# EasyEDA Pro project ProProject_iButton3.1_2024-04-16.epro

# Schematic Schematic1
Create Date: 2024-04-09; Page Name: P1; Project Name: iBtn2; Schematic Name: Schematic1; Update Date: 2024-04-09; Company: 嘉立创EDA; Page Size: A4; Version: V1.0
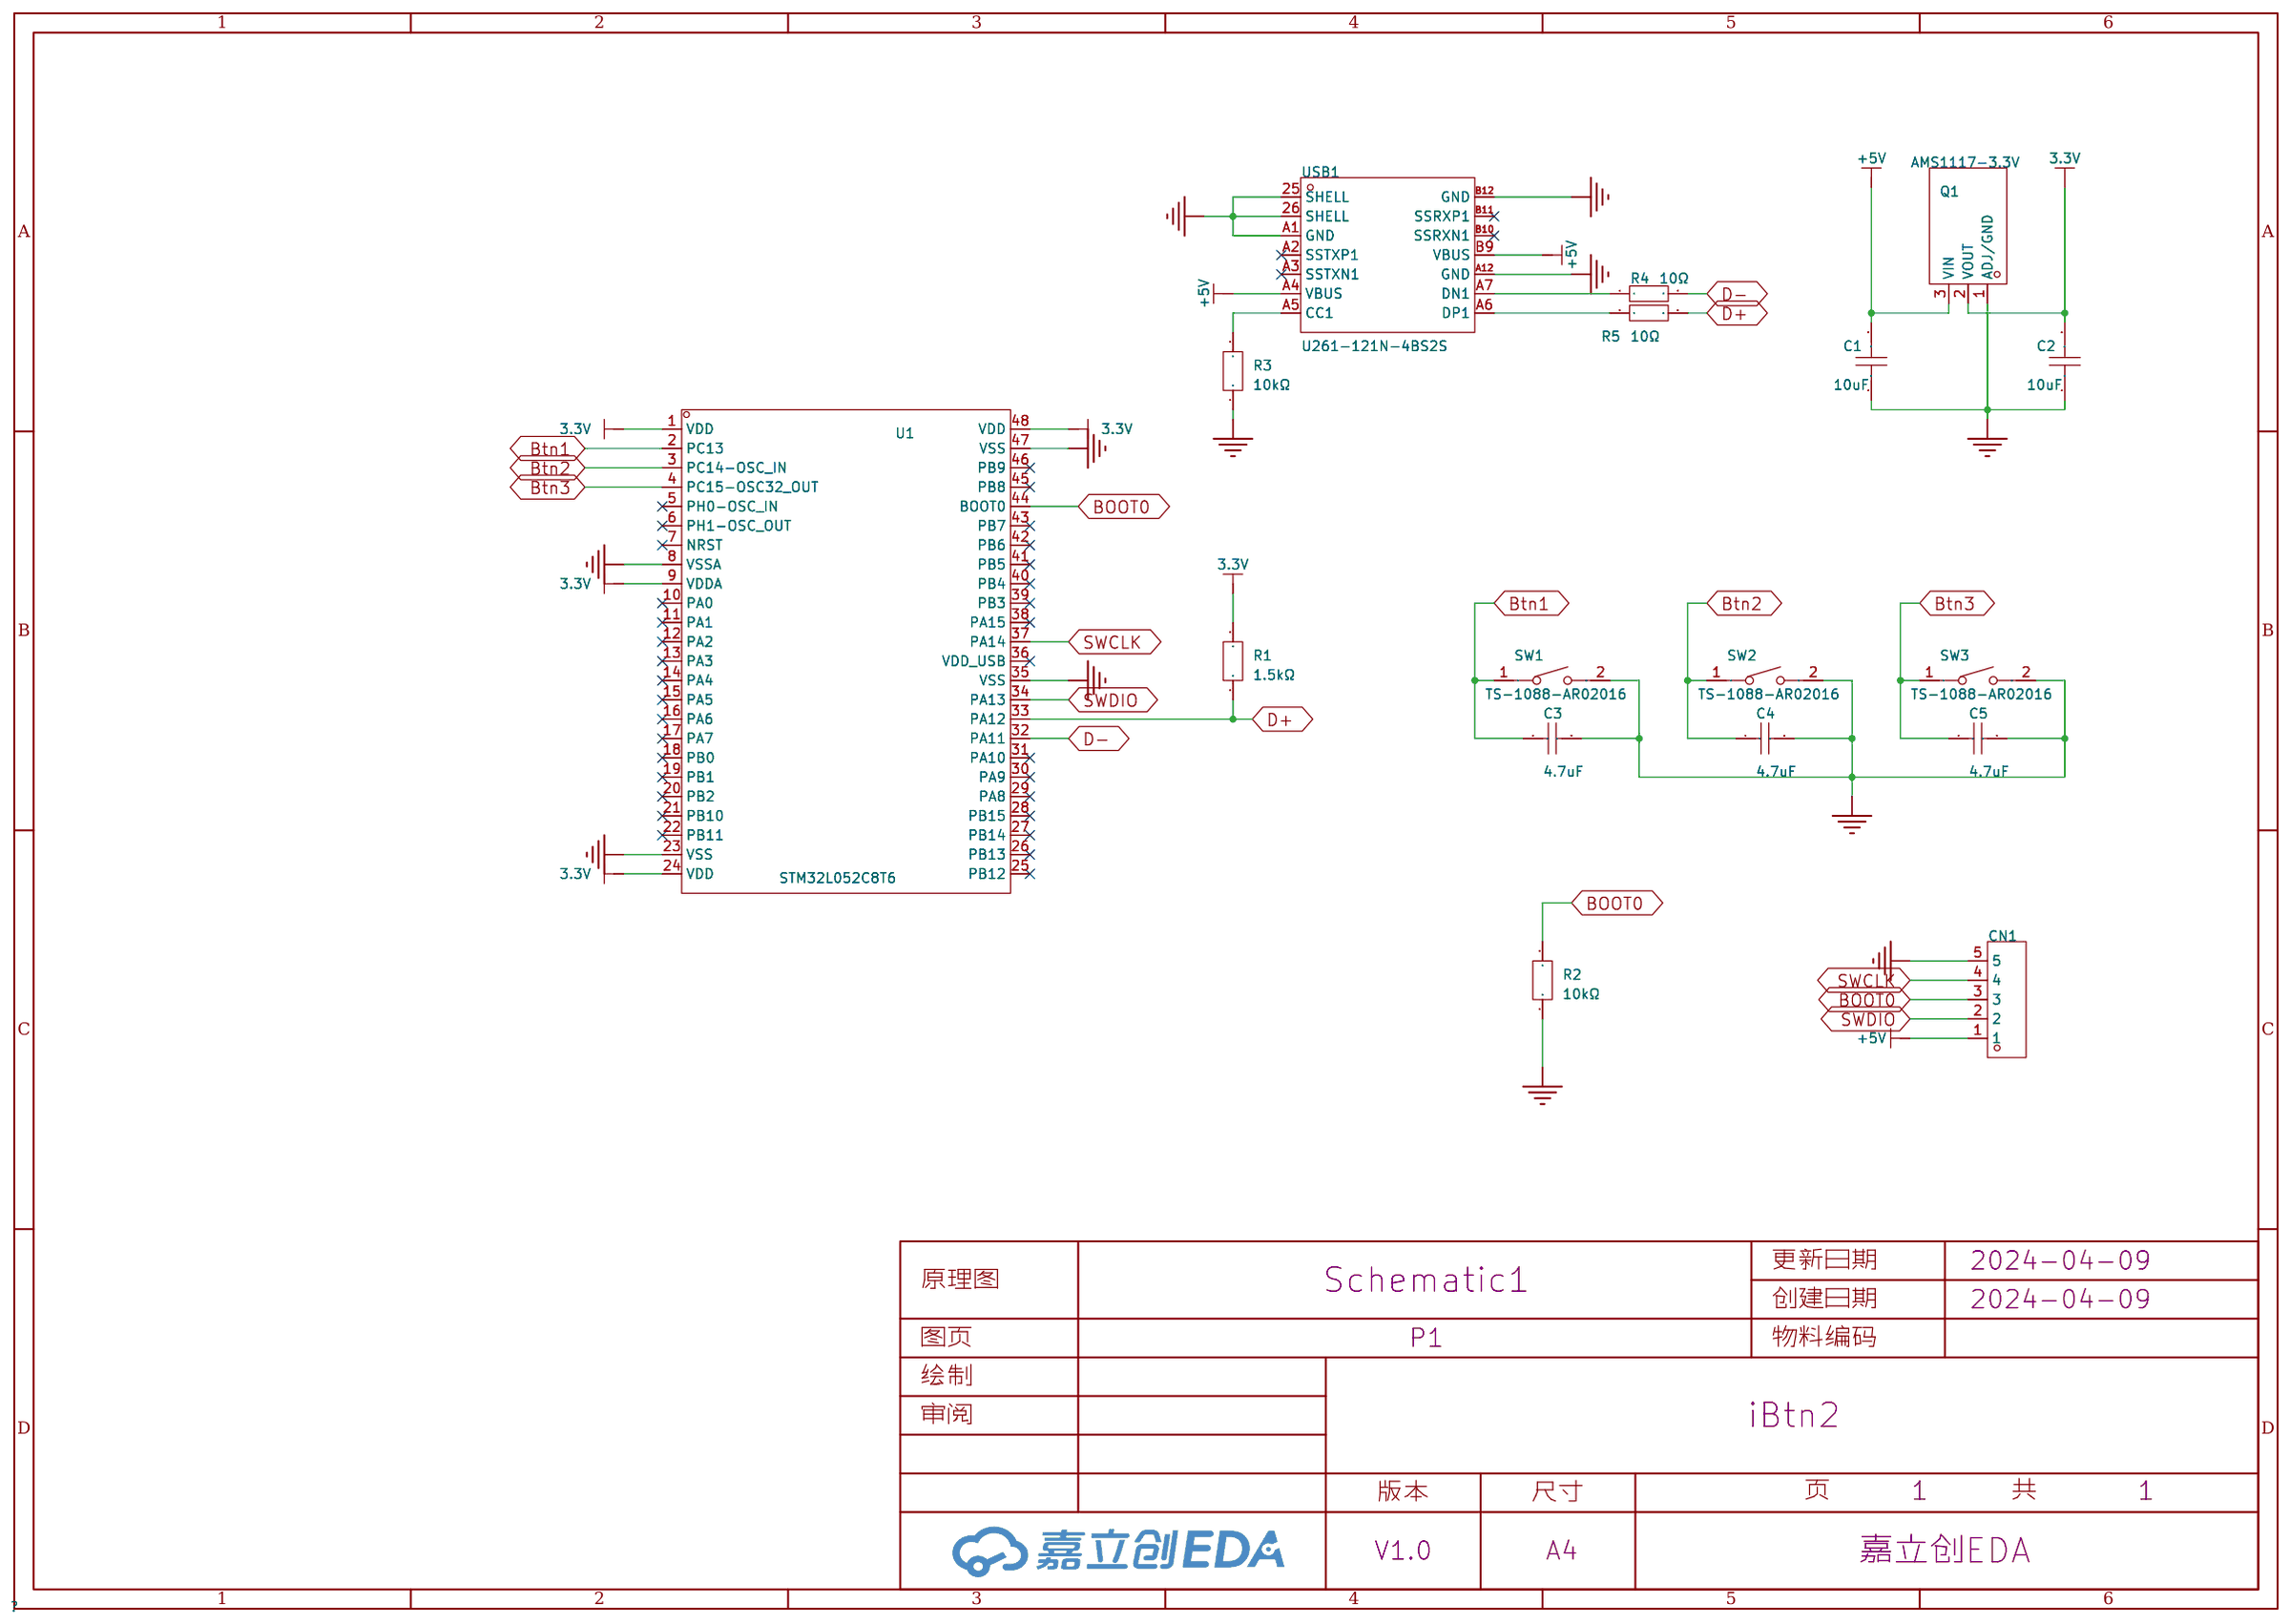
[diagram p0: schematic sheet]

## Parts
C1  10uF  [C0603]
C2  10uF  [C0603]
C3  4.7uF  [C0603]
C4  4.7uF  [C0603]
C5  4.7uF  [C0603]
CN1  MDF7-5S-2.54DSA(55)  [EdgeLink5]
Q1  AMS1117-3.3V  [SOT-89-3_L4.5-W2.5-P1.50-LS4.2-BR]
R1  1.5kΩ  [R0402]
R2  10kΩ  [R0402]
R3  10kΩ  [R0402]
R4  10Ω  [R0402]
R5  10Ω  [R0402]
SW1  TS-1088-AR02016  [SW-SMD_L3.9-W3.0-P4.45]
SW2  TS-1088-AR02016  [SW-SMD_L3.9-W3.0-P4.45]
SW3  TS-1088-AR02016  [SW-SMD_L3.9-W3.0-P4.45]
U1  STM32L052C8T6  [LQFP-48_L7.0-W7.0-P0.50-LS9.0-BL]
USB1  U261-121N-4BS2S  [USB-C-SMD_U261-121N-4BS2S]

## Library data of the parts
C1 C2 = CL10A106KP8NNNC: 容值:10uF;精度:±10%;额定电压:10V;材质(温度系数):X5R;; LCSC Part Name: 10uF ±10% 10V; Supplier Part: C19702; Manufacturer: SAMSUNG(三星); Supplier Footprint: 0603; JLCPCB Part Class: 基础库; Datasheet: https://atta.szlcsc.com/upload/public/pdf/source/20160218/1457707763339.pdf; Supplier: LCSC; Tolerance: ±10%; Voltage Rated: 10V; Temperature Coefficient: X5R
C3-C5 = CL10A475KO8NNNC: 容值:4.7uF;精度:±10%;额定电压:16V;材质(温度系数):X5R;; LCSC Part Name: 4.7uF ±10% 16V; Supplier Part: C19666; Manufacturer: SAMSUNG(三星); Supplier Footprint: 0603; JLCPCB Part Class: 基础库; Datasheet: https://atta.szlcsc.com/upload/public/pdf/source/20160218/1457707763339.pdf; Supplier: LCSC; Tolerance: ±10%; Voltage Rated: 16V; Temperature Coefficient: X5R
CN1 = MDF7-5S-2.54DSA(55): 插孔结构:1x5P;间距:2.54mm;行距:-;圆孔/方孔:方孔;安装类型:直插;排数:单排;总孔位数:5P;额定电流:3A;额定电压:250V;插孔方向:底部;塑高:5mm;触头镀层:锡;工作温度范围:-35℃~+85℃;; LCSC Part Name: 间距:2.54mm 1x5P 直插; Supplier Part: C2692083; Manufacturer: HRS(广濑); Supplier Footprint: 插件,P=2.54mm; JLCPCB Part Class: Extended Part; Datasheet: https://atta.szlcsc.com/upload/public/pdf/source/20211014/DAA5416FDEA50C439628CC91896CF424.pdf; Supplier: LCSC; Holes Structure: 1x5P; Pitch: 2.54mm; Circular Hole / Square Hole: 方孔; Mounting Type: 直插; Number of Rows: 单排; Number of Holes: 5P; Current Rating (Max): 3A; Voltage Rating (Max): 250V; Holes Direction: 底部; Insulation Height: 5mm; Contact Plating: 锡; Operating Temperature Range: -35℃~+85℃
Q1 = AMS1117-3.3V_C5120796: 输出类型:固定;最大输入电压:18V;输出电压:3.3V;最大输出电流:1A;输出极性:正极;; LCSC Part Name: 输入18V 输出3.3V 1A; Supplier Part: C5120796; Manufacturer: MSKSEMI(美森科); Supplier Footprint: SOT-89; JLCPCB Part Class: 扩展库; Datasheet: https://atta.szlcsc.com/upload/public/pdf/source/20231123/6117526697EB8BF6175FDEEBA0877266.pdf; Supplier: LCSC; Output Type: 固定; Maximum Input Voltage: 18V; Output Voltage: 3.3V; MAX Output Current: 1A; Dropout Voltage: 1.4V@(1A); standby current: 12mA; Operating Temperature: 0℃~+125℃; Output Polarity: 正极; Number of Outputs: 1
R1 = 0402WGF1501TCE: 电阻类型:厚膜电阻;阻值:1.5kΩ;精度:±1%;功率:62.5mW;最大工作电压:50V;温度系数:±100ppm/℃;; LCSC Part Name: 1.5kΩ ±1% 62.5mW 厚膜电阻; Supplier Part: C25867; Manufacturer: UNI-ROYAL(厚声); Supplier Footprint: 0402; JLCPCB Part Class: Basic Part; Datasheet: https://atta.szlcsc.com/upload/public/pdf/source/20200306/C422600_1E6D84923E4A46A82E41ADD87F860B5C.pdf; Supplier: LCSC; Type: 厚膜电阻; Tolerance: ±1%; Power(Watts): 62.5mW; Overload Voltage (Max): 50V; Temperature Coefficient: ±100ppm/℃; Operating Temperature Range: -55℃~+155℃
R2 R3 = RC0402FR-0710KL: 电阻类型:厚膜电阻;阻值:10kΩ;精度:±1%;功率:62.5mW;最大工作电压:50V;温度系数:±100ppm/℃;; LCSC Part Name: 厚膜电阻 10kΩ ±1% 62.5mW; Supplier Part: C60490; Manufacturer: YAGEO(国巨); Supplier Footprint: 0402; JLCPCB Part Class: Extended Part; Datasheet: https://atta.szlcsc.com/upload/public/pdf/source/20170925/C131467_1506321478108990263.pdf; Supplier: LCSC; Type: 厚膜电阻; Tolerance: ±1%; Power(Watts): 62.5mW; Overload Voltage (Max): 50V; Temperature Coefficient: ±100ppm/℃; Operating Temperature Range: -55℃~+155℃
R4 R5 = 0402WGF100JTCE: 电阻类型:厚膜电阻;阻值:10Ω;精度:±1%;功率:62.5mW;最大工作电压:50V;温度系数:±200ppm/℃;; LCSC Part Name: 10Ω ±1% 62.5mW 厚膜电阻; Supplier Part: C25077; Manufacturer: UNI-ROYAL(厚声); Supplier Footprint: 0402; JLCPCB Part Class: 基础库; Datasheet: https://atta.szlcsc.com/upload/public/pdf/source/20200306/C422600_1E6D84923E4A46A82E41ADD87F860B5C.pdf; Supplier: LCSC; Type: 厚膜电阻; Tolerance: ±1%; Power(Watts): 62.5mW; Overload Voltage (Max): 50V; Temperature Coefficient: ±200ppm/℃; Operating Temperature Range: -55℃~+155℃
SW1-SW3 = TS-1088-AR02016: 电路结构:单刀单掷;按钮形状:圆形按钮;作用力:160gf;安装方式:立贴;开关长度:4mm;开关宽度:3mm;开关高度:2mm;带支架:不带;触点电流:50mA;额定电压(DC):12V;绝缘电阻:100MΩ;机械寿命:10万次;; LCSC Part Name: 4*3*2mm 立贴 轻触开关; Supplier Part: C720477; Manufacturer: XUNPU(讯普); Supplier Footprint: SMD; JLCPCB Part Class: 扩展库; Datasheet: https://atta.szlcsc.com/upload/public/pdf/source/20200810/C720475_60D09DD6C54279ADDB2DC25100F1CC11.pdf; Supplier: LCSC; Circuit: 单刀单掷; Actuator Style: 圆形按钮; Operating Force: 160gf; Mounting Style: 立贴; Switch Length: 4mm; Switch Width: 3mm; Switch Height: 2mm; Strike Gundam: 不带; Contact Current: 50mA; Voltage Rating (DC): 12V; Insulation Resistance: 100MΩ; Actuator/Cap Color: 黑色; Pin Style: SMD接片; Mechanical Life: 10万次; Operating Temperature: -30℃~+80℃
U1 = STM32L052C8T6: CPU内核:ARM-M系列;程序存储容量:64KB;RAM总容量:8KB;GPIO端口数量:37;工作电压范围:1.65V~3.6V;CPU最大主频:32MHz;程序存储器类型:FLASH;; Supplier Part: C111213; Manufacturer: ST(意法半导体); Supplier Footprint: LQFP-48(7x7); JLCPCB Part Class: 扩展库; Datasheet: https://atta.szlcsc.com/upload/public/pdf/source/20180517/C222404_2834E00F4926DF798538AC243DB2EE37.pdf; Supplier: LCSC; CPU Core: ARM-M系列; Program Storage Size: 64KB; RAM Size: 8KB; GPIO Ports Number: 37; Operating Voltage Range: 1.65V~3.6V; CPU Maximum Speed: 32MHz; Program Memory Type: FLASH; Operating Temperature Range: -40℃~+85℃; ADC (Bit): 12bit; DAC (Bit): 12bit; Universal Serial Bus: 有; Peripheral/Function: PWM；PWM; Watchdog: 有; Infrared Data Association: 有; Low-Voltage Detect: 有; Direct Memory Access: 有; Internal Oscillator: 有
USB1 = U261-121N-4BS2S: 连接器类型:Type-C;标准:USB 2.0;公母:公;端口数量:1;触点数量:12P;安装方式:卧贴;额定电流 - 电源:5A;触头材质:铜合金;触头镀层:金;工作温度范围:-55℃~+85℃;焊接温度(最大值):260℃;; LCSC Part Name: Type-C 公 卧贴; Supplier Part: C2879827; Manufacturer: XKB Connectivity(中国星坤); Supplier Footprint: SMD; JLCPCB Part Class: 扩展库; Datasheet: https://atta.szlcsc.com/upload/public/pdf/source/20230717/E21107E9DFF35184454CF0943FCE0581.pdf; Supplier: LCSC; Connector Type: Type-C; Standard: USB 2.0; Gender: 公; Number of Ports: 1; Number of Contacts: 12P; Mounting Style: 卧贴; Current Rating - Power (Max): 5A; Contact Material: 铜合金; Contact Plating: 金; Operating Temperature Range: -55℃~+85℃; Soldering Temperature(Max): 260℃

## Nets
3.3V: C2.2 Q1.2(VOUT) R1.2 U1.1(VDD) U1.9(VDDA) U1.24(VDD) U1.48(VDD)
+5V: C1.2 CN1.1 Q1.3(VIN) USB1.A4(VBUS) USB1.B9(VBUS)
GND: C1.1 C2.1 C3.2 C4.2 C5.2 CN1.5 Q1.1(ADJ/GND) R2.1 R3.1 SW1.2 SW2.2 SW3.2 U1.8(VSSA) U1.23(VSS) U1.35(VSS) U1.47(VSS) USB1.25(SHELL) USB1.26(SHELL) USB1.A1(GND) USB1.A12(GND) USB1.B12(GND)
BOOT0: CN1.3 R2.2 U1.44(BOOT0)
Btn1: C3.1 SW1.1 U1.2(PC13)
Btn2: C4.1 SW2.1 U1.3(PC14-OSC_IN)
Btn3: C5.1 SW3.1 U1.4(PC15-OSC32_OUT)
D+: R1.1 R5.2 U1.33(PA12)
D-: R4.2 U1.32(PA11)
SWCLK: CN1.4 U1.37(PA14)
SWDIO: CN1.2 U1.34(PA13)
$1N3077: R3.2 USB1.A5(CC1)
$1N3302: R4.1 USB1.A7(DN1)
$1N3305: R5.1 USB1.A6(DP1)

Not connected (* = marked no-connect by the designer): U1 5(PH0-OSC_IN)* 6(PH1-OSC_OUT)* 7(NRST)* 10(PA0)* 11(PA1)* 12(PA2)* 13(PA3)* 14(PA4)* 15(PA5)* 16(PA6)* 17(PA7)* 18(PB0)* 19(PB1)* 20(PB2)* 21(PB10)* 22(PB11)* 25(PB12)* 26(PB13)* 27(PB14)* 28(PB15)* 29(PA8)* 30(PA9)* 31(PA10)* 36(VDD_USB)* 38(PA15)* 39(PB3)* 40(PB4)* 41(PB5)* 42(PB6)* 43(PB7)* 45(PB8)* 46(PB9)*; USB1 A2(SSTXP1)* A3(SSTXN1)* B10(SSRXN1)* B11(SSRXP1)*

# Board PCB1
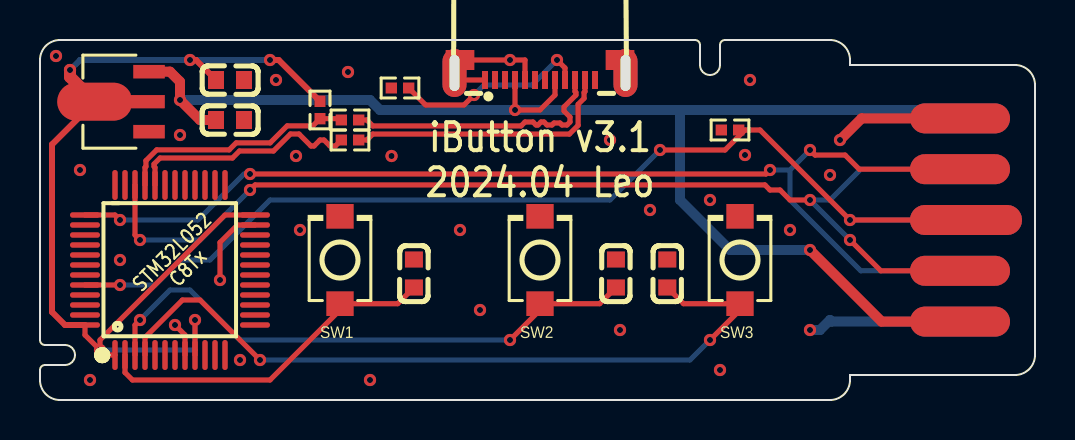
[diagram p1: board, top side]
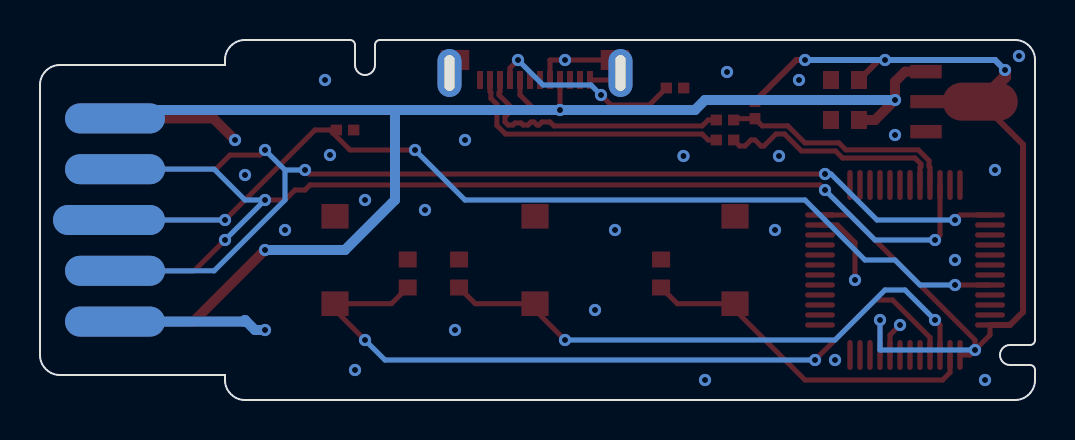
[diagram p2: board, bottom side, seen from below]

Outline 49.75 x 18 mm; copper layers: Top Layer, Bottom Layer. Coordinates in mm from the lower left corner of the outline.
Outline path: 0,17 arc(0.29,17.71) 1,18 32.75,18 arc(32.93,17.93) 33,17.75 33,16.75 arc(33.5,16.25) 34,16.75 34,17.75 arc(34.07,17.93) 34.25,18 39.5,18 arc(40.21,17.71) 40.5,17 40.5,16.75 48.75,16.75 arc(49.46,16.46) 49.75,15.75 49.75,2.25 arc(49.46,1.54) 48.75,1.25 40.5,1.25 40.5,1 arc(40.21,0.29) 39.5,0 1,0 arc(0.29,0.29) 0,1 0,1.5 arc(0.07,1.68) 0.25,1.75 1.25,1.75 arc(1.75,2.25) 1.25,2.75 0.25,2.75 arc(0.07,2.82) 0,3 0,17
Stack: Top Layer 0.035mm / Dielectric1 1.51mm FR4 er 4.5 / Bottom Layer 0.035mm

## Design rules (mm)
net D+: DP1
net D-: DP1
net $1N3305: DP2
net $1N3302: DP2
template: JLCPCB Capability(Two Layers Board)
spacing copperThickness1oz (default): track to track 0.102, other pairs 0.152 to 0.3
spacing copperThickness2oz: track to track 0.203, other pairs 0.152 to 0.3
track width copperThickness1oz (default): min 0.127, default 0.254, max 2.54
track width copperThickness2oz: min 0.203, default 0.254, max 2.54
differential pair differentialPair (default): width min 0.127, default 0.254, max 2.54; gap min 0.152, default 0.152
via viaSize (default): diameter min 0.5, default 0.61, max 10; hole min 0.3, default 0.305, max 6.3

## Placement (name value [footprint] x y rotation side)
C1  10uF  [C0603]  9.5 14 180 top
C2  10uF  [C0603]  9.5 16 180 top
C3  4.7uF  [C0603]  18.7 6.33 90 top
C4  4.7uF  [C0603]  28.8 6.33 90 top
C5  4.7uF  [C0603]  31.37 6.33 90 top
CN1  MDF7-5S-2.54DSA(55)  [EdgeLink5]  46 9 0 top
Q1  AMS1117-3.3V  [SOT-89-3_L4.5-W2.5-P1.50-LS4.2-BR]  4.1 14.92 0 top
R1  1.5kΩ  [R0402]  14 14.5 90 top
R2  10kΩ  [R0402]  34.5 13.5 0 top
R3  10kΩ  [R0402]  18 15.6 0 top
R4  10Ω  [R0402]  15.5 13 180 top
R5  10Ω  [R0402]  15.5 14 180 top
SW1  TS-1088-AR02016  [SW-SMD_L3.9-W3.0-P4.45]  15 7 90 top
SW2  TS-1088-AR02016  [SW-SMD_L3.9-W3.0-P4.45]  25 7 90 top
SW3  TS-1088-AR02016  [SW-SMD_L3.9-W3.0-P4.45]  35 7 90 top
U1  STM32L052C8T6  [LQFP-48_L7.0-W7.0-P0.50-LS9.0-BL]  6.5 6.5 0 top
USB1  U261-121N-4BS2S  [usb-c-smd_u261-121n-4bs2s]  25 16.5 180 top

## Footprints (pads in the part's own frame, mm; a bottom-side part is the same pattern mirrored in y, then rotated)
C0603
  rect 0.8x0.9 smd: 1(-0.7,0) 2(0.7,0)
EdgeLink5
  oval 5x1.5 smd far side: 1(0,5.08) 2(0,2.54) 4(0,-2.54) 5(0,-5.08)
  oval 5x1.5 smd: 1(0,-5.08) 2(0,-2.54) 4(0,2.54) 5(0,5.08)
  oval 5.6x1.5 smd: 3(0.3,0)
  oval 5.6x1.5 smd far side: 3(0.3,0)
LQFP-48_L7.0-W7.0-P0.50-LS9.0-BL
  oval 0.27x1.5 smd: 1(-2.75,-4.25) 2(-2.25,-4.25) 3(-1.75,-4.25) 4(-1.25,-4.25) 5(-0.75,-4.25) 6(-0.25,-4.25) 7(0.25,-4.25) 8(0.75,-4.25) 9(1.25,-4.25) 10(1.75,-4.25) 11(2.25,-4.25) 12(2.75,-4.25) 25(2.75,4.25) 26(2.25,4.25) 27(1.75,4.25) 28(1.25,4.25) 29(0.75,4.25) 30(0.25,4.25) 31(-0.25,4.25) 32(-0.75,4.25) 33(-1.25,4.25) 34(-1.75,4.25) 35(-2.25,4.25) 36(-2.75,4.25)
  oval 1.5x0.27 smd: 13(4.25,-2.75) 14(4.25,-2.25) 15(4.25,-1.75) 16(4.25,-1.25) 17(4.25,-0.75) 18(4.25,-0.25) 19(4.25,0.25) 20(4.25,0.75) 21(4.25,1.25) 22(4.25,1.75) 23(4.25,2.25) 24(4.25,2.75) 37(-4.25,2.75) 38(-4.25,2.25) 39(-4.25,1.75) 40(-4.25,1.25) 41(-4.25,0.75) 42(-4.25,0.25) 43(-4.25,-0.25) 44(-4.25,-0.75) 45(-4.25,-1.25) 46(-4.25,-1.75) 47(-4.25,-2.25) 48(-4.25,-2.75)
R0402
  rect 0.566x0.54 smd: 1(-0.433,0) 2(0.433,0)
SOT-89-3_L4.5-W2.5-P1.50-LS4.2-BR
  rect 1.575x0.672 smd: 1(1.356,-1.5) 3(1.356,1.5)
  custom 5.377x1.9 smd: 2(-1.356,0)
SW-SMD_L3.9-W3.0-P4.45
  rect 1.23x1.36 smd: 1(-2.185,0) 2(2.185,0)
usb-c-smd_u261-121n-4bs2s
  oval 1.2x2.4 hole 0.5x1.8: 25(-4.275,0.15) 26(4.275,0.15)
  rect 1.43x1 smd: 25(-4,-0.5) 26(4,-0.5)
  rect 0.3x0.9 smd: A1(2.75,0.5) A2(2.25,0.5) A3(1.75,0.5) A4(1.25,0.5) A5(-1.25,0.5) A6(-1.75,0.5) A7(-2.25,0.5) A12(-2.75,0.5) B9(-0.75,0.5) B10(-0.25,0.5) B11(0.25,0.5) B12(0.75,0.5)

## Nets
3.3V: C2.2 Q1.2 R1.2 U1.1 U1.9 U1.24 U1.48
+5V: C1.2 CN1.1 Q1.3 USB1.A4 USB1.B9
GND: C1.1 C2.1 C3.2 C4.2 C5.2 CN1.5 Q1.1 R2.1 R3.1 SW1.2 SW2.2 SW3.2 U1.8 U1.23 U1.35 U1.47 USB1.25 USB1.26 USB1.A1 USB1.A12 USB1.B12
BOOT0: CN1.3 R2.2 U1.44
BTN1: C3.1 SW1.1 U1.2
BTN2: C4.1 SW2.1 U1.3
BTN3: C5.1 SW3.1 U1.4
D+: R1.1 R5.2 U1.33
D-: R4.2 U1.32
SWCLK: CN1.4 U1.37
SWDIO: CN1.2 U1.34
$1N3077: R3.2 USB1.A5
$1N3302: R4.1 USB1.A7
$1N3305: R5.1 USB1.A6

Pads without a net: U1 5 6 7 10 11 12 13 14 15 16 17 18 19 20 21 22 25 26 27 28 29 30 31 36 38 39 40 41 42 43 45 46; USB1 A2 A3 B10 B11

## Via types
v1: diameter 0.61, hole 0.305, Top Layer to Bottom Layer, 53 vias

## Routing (per net, layer and track width the routed paths; a pad name or vN(x,y) marks a point on that pad's centre or on a via; arc(x,y) is an arc through that point)
3.3V: length 51.9
  Top Layer w0.254: v1(3,2.5) 3.25,2.25 U1.1 ; v1(3,2.5) 3,3 9.25,9.25 U1.24 ; v1(3,2.5) 2.25,3.25 U1.48 ; U1.9 v1(7.75,4)
  Top Layer w0.3: v1(11.5,17) 11.93,17 R1.2 ; v1(7.5,17) 7.8,17 C2.2 ; Q1.2 0.6,12.78 0.6,4.4 1.25,3.75 U1.48
  Top Layer w0.6: Q1.2 1.5,16.16 v1(1.5,16.5)
  Bottom Layer w0.254: v1(3,2.5) 7.75,2.5 v1(7.75,4)
  Bottom Layer w0.3: v1(1.5,16.5) 2,17 v1(7.5,17) v1(11.5,17)
+5V: length 69.9
  Top Layer w0.254: USB1.B9 25.75,15.25 25,14.5 v1(23.75,14.5) 23.75,14.5 USB1.A4
  Top Layer w0.5: v1(38.5,7.5) 42.08,3.92 CN1.1 ; Q1.3 6.5,16.42 7,15.92 v1(7,15) 8,14 C1.2
  Bottom Layer w0.5: 31.91,14.5 v1(23.75,14.5) 17,14.5 16.5,15 v1(7,15) ; 31.91,14.5 45.58,14.5 CN1.1 ; 31.91,14.5 32,14.41 32,10 34.5,7.5 v1(38.5,7.5)
GND: length 26.3
  Top Layer w0.254: USB1.A1 21.07,16 USB1.26 21.38,17 v1(23.5,17) 24.25,17 USB1.B12 ; v1(9,6) 9,7.88 9.87,8.75 U1.23 ; U1.8 7.25,3.25 v1(6.75,3.75)
  Top Layer w0.5: v1(40,13) 41.08,14.08 CN1.5
  Bottom Layer w0.5: v1(38.5,3.5) 39,3.5 39.5,4 39.58,3.92 CN1.5
  vias: v1(0.8,17.2) v1(2,11.5) v1(2.5,1) v1(4,7) v1(7,13.25) v1(10,2) v1(11.8,16) v1(12.8,12.2) v1(13,8.5) v1(15.4,16.4) v1(16.5,1) v1(17.58,12.2) v1(21,8.5) v1(22,4.5) v1(28.5,13) v1(29,3.5) v1(30.5,9.5) v1(33.5,10) v1(34,1.5) v1(35.25,12.25) v1(35.5,16) v1(37.5,8.5) v1(39.5,11.25)
BOOT0: length 54.9
  Top Layer w0.254: CN1.3 v1(40.5,9) 36,13.5 35.25,13.5 34.25,12.5 v1(31,12.5) ; U1.44 v1(4,5.75)
  Bottom Layer w0.254: CN1.3 v1(40.5,9) ; v1(4,5.75) 5.75,5.75 7,7 8.5,7 11.5,10 28.5,10 v1(31,12.5)
BTN1: length 17.6
  Top Layer w0.254: C3.1 17.89,4.81 SW1.1 15,4.5 11.5,1 4.62,1 4.25,1.37 U1.2
BTN2: length 28.6
  Top Layer w0.254: U1.3 4.75,3.75 v1(5,4) ; C4.1 27.99,4.81 SW2.1 25,4.5 v1(23.5,3)
  Bottom Layer w0.254: v1(5,4) 6.5,5.5 7.5,5.5 10,3 v1(23.5,3)
BTN3: length 38
  Top Layer w0.254: v1(11,2) 8,5 7.12,5 5.25,3.13 U1.4 ; C5.1 32.18,4.81 SW3.1 35,4.5 v1(33.5,3)
  Bottom Layer w0.254: v1(11,2) 32.5,2 v1(33.5,3)
D+: length 11.9
  Top Layer w0.254: U1.33 5.25,11.63 5.3,11.67 5.3,11.97 5.83,12.51 9.46,12.51 9.81,12.86 11.51,12.86 12.36,13.71 13.64,13.71 R1.1 15,14.07 R5.2
D-: length 11.7
  Top Layer w0.254: U1.32 5.75,11.63 5.7,11.67 5.7,11.8 6,12.1 9.62,12.1 9.97,12.45 11.67,12.45 12.52,13.3 12.95,13.3 13.55,12.7 13.7,12.7 14,13 14.2,13 14.5,12.7 14.77,12.7 R4.2
SWCLK: length 57.2
  Top Layer w0.254: CN1.4 40.96,11.54 40.25,12.25 38.75,12.25 v1(38.5,12.5) ; U1.37 3.75,9.25 v1(4,9) ; v1(10.5,11.3) 36.3,11.3 v1(36.5,11.5)
  Bottom Layer w0.254: CN1.4 41.04,6.46 37.5,10 37.5,11.5 ; v1(38.5,12.5) 37.5,11.5 ; 37.5,11.5 v1(36.5,11.5) ; v1(10.5,11.3) 10.2,11.3 7.9,9 v1(4,9)
SWDIO: length 54.9
  Top Layer w0.254: v1(5,8) 4.75,8.25 U1.34 ; v1(38.5,10) 37.5,10 37,10.5 36.5,10.5 36.25,10.75 10.75,10.75 v1(10.5,10.5) ; CN1.2 42.04,6.46 v1(40.5,8)
  Bottom Layer w0.254: CN1.2 41.04,11.54 39.5,10 v1(38.5,10) v1(40.5,8) ; v1(10.5,10.5) 8,8 v1(5,8)
$1N3077: length 9.9
  Top Layer w0.254: v1(25.85,17) 26.25,16.6 USB1.A5 ; R3.2 19.28,14.75 21.2,14.75 v1(21.7,15.25)
  Bottom Layer w0.254: v1(25.85,17) 24.6,15.75 22.2,15.75 v1(21.7,15.25)
$1N3302: length 13.7
  Top Layer w0.254: R4.1 16.34,13 16.64,13.3 26.47,13.3 26.91,13.73 26.91,14.78 27.2,15.08 27.2,15.38 27.25,15.42 USB1.A7
$1N3305: length 13.6
  Top Layer w0.254: R5.1 16.34,14 16.64,13.7 24.05,13.7 24.25,13.9 24.65,13.9 24.8,13.75 24.9,13.75 25.05,13.9 25.2,13.9 25.35,13.75 25.6,13.75 25.7,13.85 26,13.85 26.1,13.75 26.35,13.75 26.5,13.9 26.5,14.15 26.2,14.45 26.2,14.65 26.8,15.25 26.8,15.38 26.75,15.42 USB1.A6

## Copper pours and planes (outline as drawn; the poured copper is in the pictures)
GND on Top Layer: -0.5,19 40.5,19 40.5,-1 -0.5,-1
GND on Bottom Layer: -1,18.5 40.5,18.5 40.5,-0.5 -1,-0.5

## Text on the board
Top Silkscreen Layer: STM32L052 / C8Tx | iButton v3.1 / 2024.04 Leo
